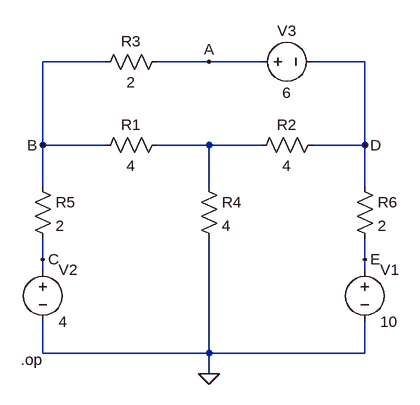
[diagram p0: schematic Draft31.asc]
Draft31.asc, the LTspice schematic file:
Version 4
SHEET 1 880 680
WIRE 48 48 -48 48
WIRE 208 48 128 48
WIRE 288 48 208 48
WIRE 448 48 368 48
WIRE -48 176 -48 48
WIRE 48 176 -48 176
WIRE 208 176 128 176
WIRE 288 176 208 176
WIRE 448 176 448 48
WIRE 448 176 368 176
WIRE -48 240 -48 176
WIRE 208 240 208 176
WIRE 448 240 448 176
WIRE -48 352 -48 320
WIRE 448 352 448 320
WIRE -48 368 -48 352
WIRE 448 368 448 352
WIRE -48 496 -48 448
WIRE 208 496 208 320
WIRE 208 496 -48 496
WIRE 448 496 448 448
WIRE 448 496 208 496
WIRE 208 528 208 496
FLAG 208 528 0
FLAG 208 48 A
FLAG -48 176 B
FLAG -48 352 C
FLAG 448 176 D
FLAG 448 352 E
SYMBOL res 144 160 R90
WINDOW 0 0 56 VBottom 2
WINDOW 3 32 56 VTop 2
SYMATTR InstName R1
SYMATTR Value 4
SYMBOL res 384 160 R90
WINDOW 0 0 56 VBottom 2
WINDOW 3 32 56 VTop 2
SYMATTR InstName R2
SYMATTR Value 4
SYMBOL res 144 32 R90
WINDOW 0 0 56 VBottom 2
WINDOW 3 32 56 VTop 2
SYMATTR InstName R3
SYMATTR Value 2
SYMBOL res 192 224 R0
SYMATTR InstName R4
SYMATTR Value 4
SYMBOL res -64 224 R0
SYMATTR InstName R5
SYMATTR Value 2
SYMBOL res 432 224 R0
SYMATTR InstName R6
SYMATTR Value 2
SYMBOL voltage 448 352 R0
WINDOW 123 0 0 Left 0
WINDOW 39 0 0 Left 0
SYMATTR InstName V1
SYMATTR Value 10
SYMBOL voltage -48 352 R0
WINDOW 123 0 0 Left 0
WINDOW 39 0 0 Left 0
SYMATTR InstName V2
SYMATTR Value 4
SYMBOL voltage 272 48 R270
WINDOW 0 32 56 VTop 2
WINDOW 3 -32 56 VBottom 2
WINDOW 123 0 0 Left 0
WINDOW 39 0 0 Left 0
SYMATTR InstName V3
SYMATTR Value 6
TEXT -82 506 Left 2 !.op

The netlist it stands for:
* Draft31.asc
R1 N001 B 4
R2 D N001 4
R3 A B 2
R4 N001 0 4
R5 B C 2
R6 D E 2
V1 E 0 10
V2 C 0 4
V3 A D 6
.op
.backanno
.end